# EAGLE design elektrosluch (EAGLE 6.4)
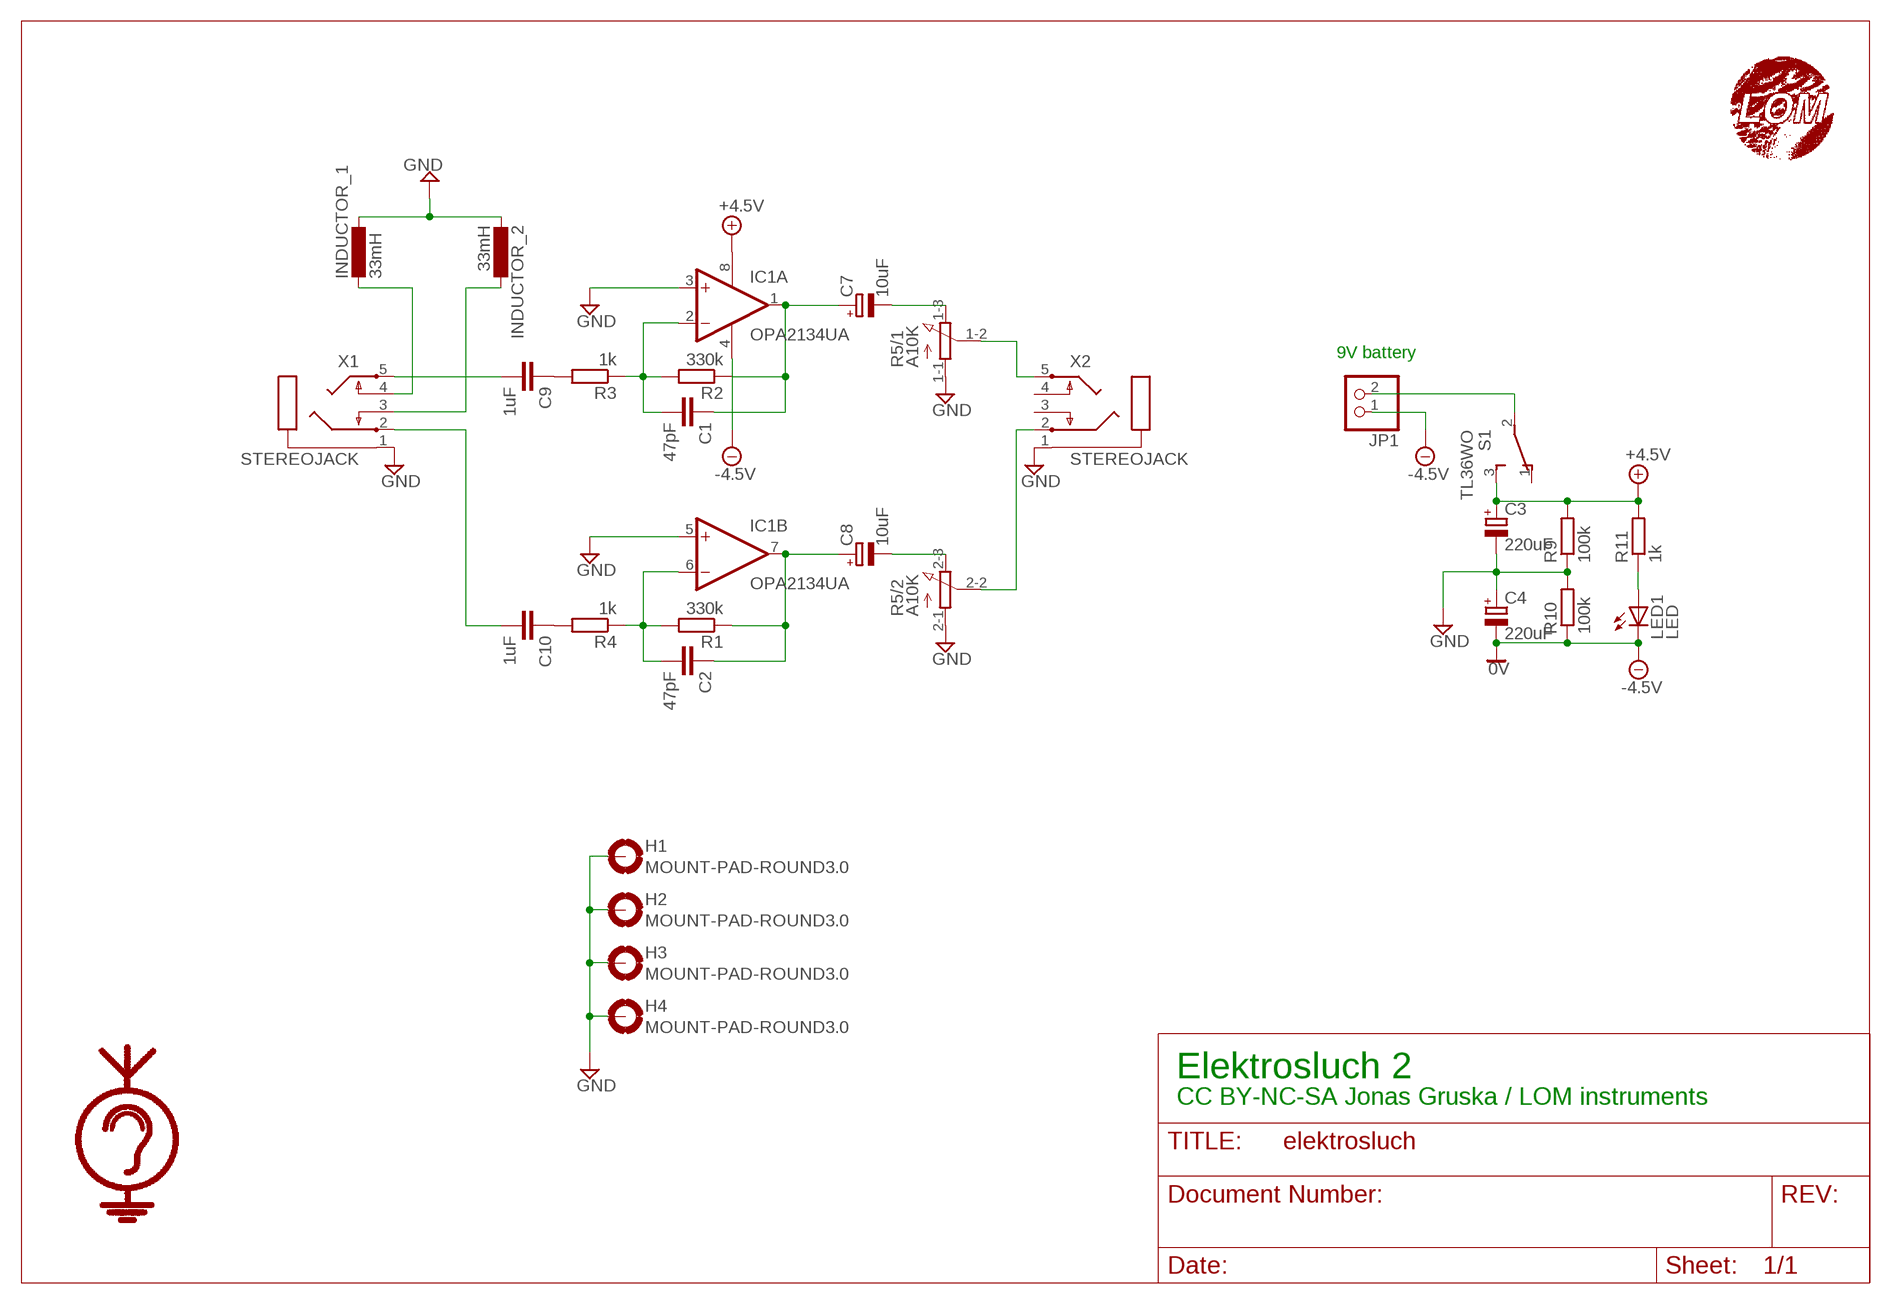
[diagram p0: schematic, sheet 1]

## Parts
C1  47pF  C-EUC1206  [C1206]
C2  47pF  C-EUC1206  [C1206]
C3  220uF  CPOL-EUD  [PANASONIC_D]
C4  220uF  CPOL-EUD  [PANASONIC_D]
C7  10uF  CPOL-EUB  [PANASONIC_B]
C8  10uF  CPOL-EUB  [PANASONIC_B]
C9  1uF  C-EUC1812  [C1812]
C10  1uF  C-EUC1812  [C1812]
H1  MOUNT-PAD-ROUND3.0  [3,0-PAD]
H2  MOUNT-PAD-ROUND3.0  [3,0-PAD]
H3  MOUNT-PAD-ROUND3.0  [3,0-PAD]
H4  MOUNT-PAD-ROUND3.0  [3,0-PAD]
IC1  OPA2134UA  [SO08]
INDUCTOR_1  33mH  COIL  [COIL]
INDUCTOR_2  33mH  COIL  [COIL]
JP1  PINHD-1X2  [1X02]
LED1  LED  [LED3MM]
R1  330k  R-EU_M1206  [M1206]
R2  330k  R-EU_M1206  [M1206]
R3  1k  R-EU_M1206  [M1206]
R4  1k  R-EU_M1206  [M1206]
R5  A10K  3RP/1610G  [3RP/1610G]
R9  100k  R-EU_M1206  [M1206]
R10  100k  R-EU_M1206  [M1206]
R11  1k  R-EU_M1206  [M1206]
S1  TL36WO  [TL3XWO]
U$3  LOM  [LOMLOGO]
U$5  ELEKTROSLUCH  [ELEKTROSLUCH]
X1  STEREOJACK  [STX3100]
X2  STEREOJACK  [STX3100]

## Nets
+5V: C3.+ IC1.8(A:V+) R9.2 R11.2 S1.3(S) ; supply symbol labelled +4.5V
-5V: C4.- IC1.4(A:V-) JP1.1 LED1.K(C) R10.1 ; supply symbol labelled -4.5V, 0V
GND: C3.- C4.+ H1.B3,0(MOUNT) H2.B3,0(MOUNT) H3.B3,0(MOUNT) H4.B3,0(MOUNT) IC1.3(A:+IN) IC1.5(B:+IN) INDUCTOR_1.P$1 INDUCTOR_2.P$2 R5.1-1 R5.2-1 R9.1 R10.2 X1.1 X2.1
N$1: C1.2 IC1.2(A:-IN) R2.2 R3.1
N$2: C1.1 C7.+ IC1.1(A:OUT) R2.1
N$3: C7.- R5.1-3
N$4: C2.2 IC1.6(B:-IN) R1.2 R4.1
N$5: C2.1 C8.+ IC1.7(B:OUT) R1.1
N$6: C8.- R5.2-3
N$7: R5.1-2 X2.5
N$8: C9.2 X1.5
N$9: R5.2-2 X2.2
N$10: C10.2 X1.2
N$11: C9.1 R3.2
N$12: INDUCTOR_1.P$2 X1.4
N$13: INDUCTOR_2.P$1 X1.3
N$14: LED1.A R11.1
N$15: C10.1 R4.2
N$16: JP1.2 S1.2(P)
Unconnected: S1.1(O) X2.3 X2.4

## Notes on the sheet
- 9V battery
- Elektrosluch 2
- CC BY-NC-SA Jonas Gruska / LOM instruments

## Library data of the parts
C1 C2 C9 C10 = rcl:C-EU: CAPACITOR, European symbol
C3 C4 C7 C8 = rcl:CPOL-EU: POLARIZED CAPACITOR, European symbol
H1-H4 = holes:MOUNT-PAD-ROUND: MOUNTING PAD, round
IC1 = linear:OPA2*: Dual Operational Amplifier Low Power, Single-Supply, Rail-To-Rail Operational Amplifier Source: http://focus.ti.com/lit/ds/symlink/opa2345.pdf http://focus.ti.com .. opa241.pdf http://focus.ti.com/lit/ds/symlink/opa2134.pdf
INDUCTOR_1 INDUCTOR_2 = mojakniznica:COIL
JP1 = pinhead:PINHD-1X2: PIN HEADER
LED1 = mojakniznica:LED
R1-R4 R9-R11 = rcl:R-EU_: RESISTOR, European symbol
R5 = pot:3RP/1610G: 16mm Potentiometer two level Source: http://www.alphapotentiometers.net/html/16mm_pot_2.html
S1 = switch:TL36WO: TINY SWITCH ON - ON Source: http://www2.produktinfo.conrad.com/datenblaetter/700000-724999/705152-da-01-de-Subminiaturschalter_TL_36WO.pdf
U$3 = mojakniznica:LOM; LOMLOGO: LOMLOGO
U$5 = mojakniznica:ELEKTROSLUCH
X1 X2 = adafruit:STEREOJACK: MIC/HEADPHONE JACK Stereo jack with two switches. Kycon STX3100, CUI SJ1-3555NG and/or 4UCon 05544

## Board
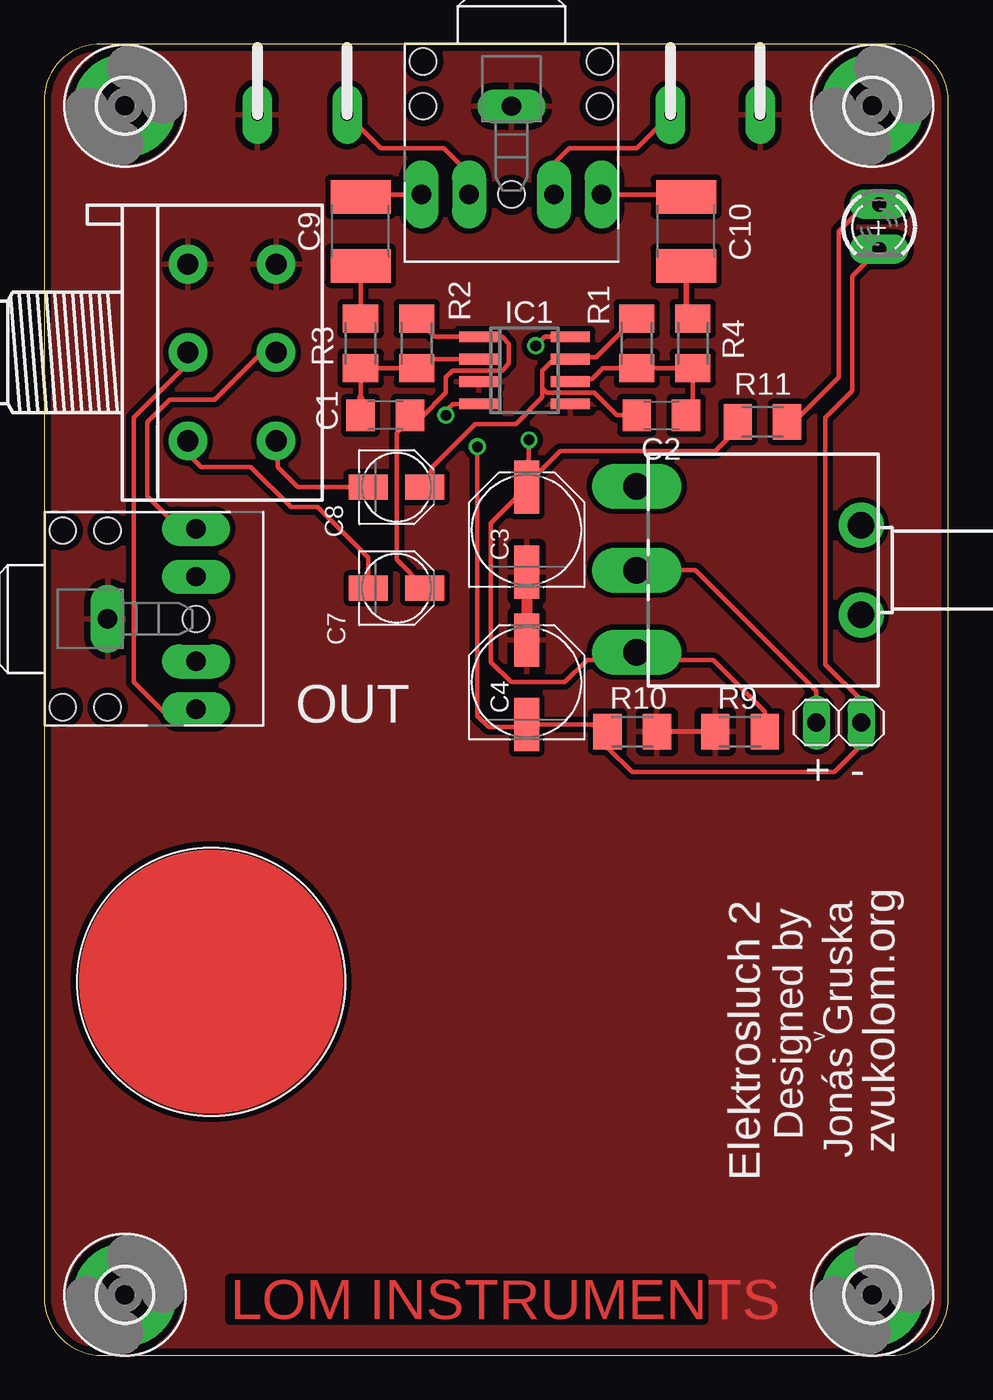
[diagram p1: board, top side]
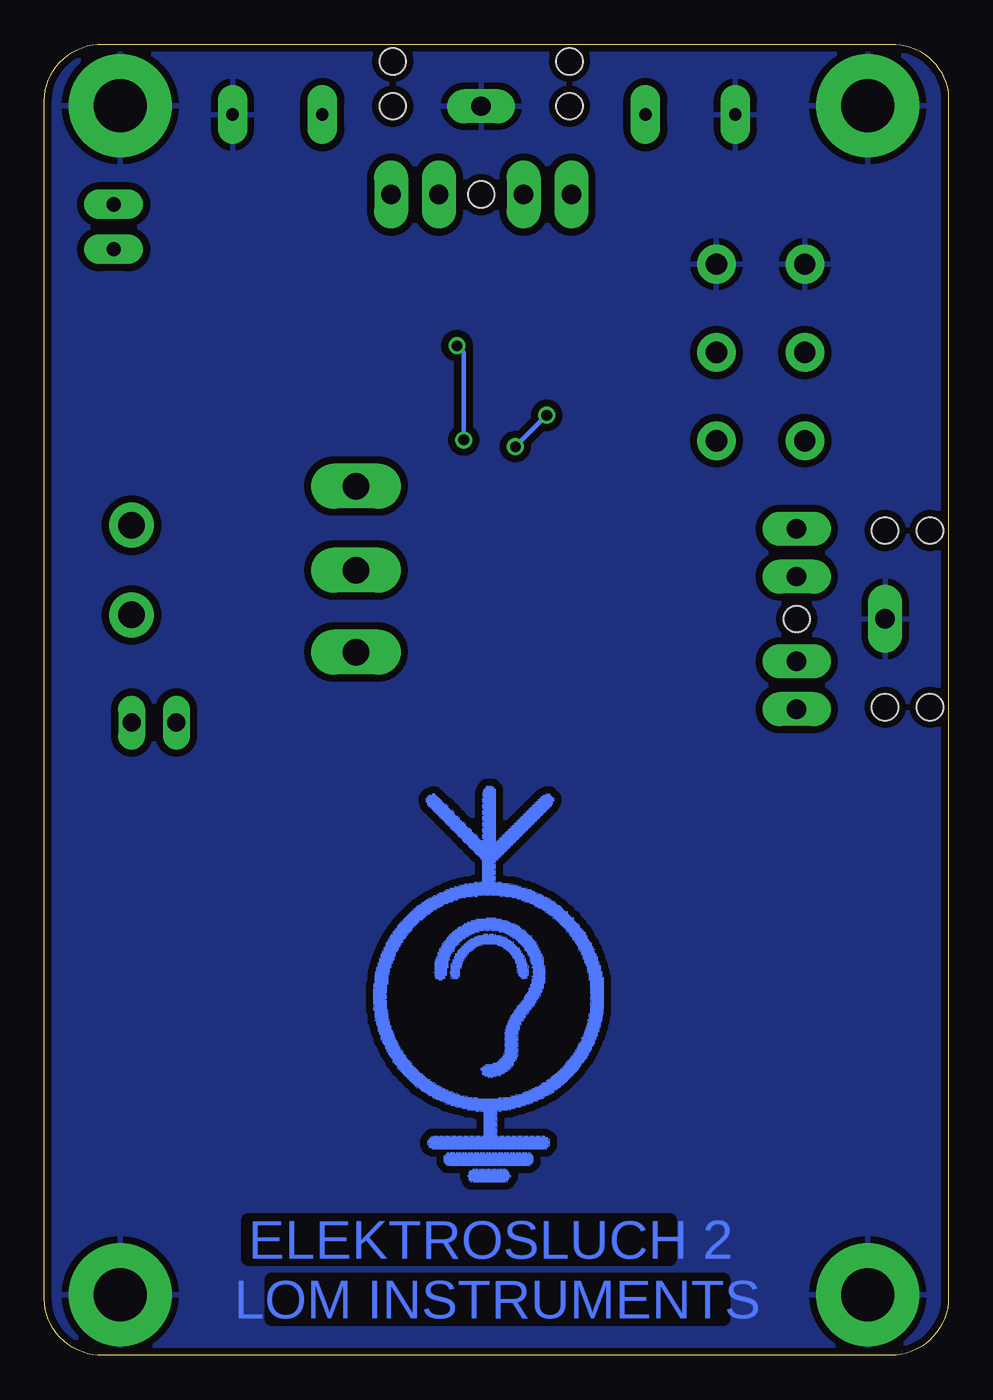
[diagram p2: board, bottom side, seen from below]

Size 51.17 x 74.22 mm. Coordinates in mm from the lower left corner, seen from the top.
Outline: 0,71.2 0,3.27 arc90 3.27,0 48.15,0 arc90 51.16,3.52 51.16,70.69 arc90 48.15,74.22 3.27,74.22 arc90 0,71.2
Copper layers (1*16): Top 0.0356mm / dielectric 1.5011mm / Bottom 0.0356mm
Design rules "LaenPCBOrder *": minimum track width 6mil, minimum drill 13mil, track to track 6mil, track to pad 6mil, pad to pad 6mil, via to via 6mil, smd to smd 6mil, copper to edge 15mil, drill to drill 6mil, minimum pad ring 7mil, minimum via ring 7mil, stop-mask expansion 3mil, vias tented up to drill 0mil, thermal gap 15mil

### Footprints (pad centres in the part's own frame; a part is rotated, then mirrored left to right if it is on the bottom)
C1206 = smd 1.6 x 1.8: 1 -1.4,0; 2 1.4,0
PANASONIC_D = smd 3 x 1.4: + 2.4,0; - -2.4,0
PANASONIC_B = smd 2.2 x 1.4: + 1.6,0; - -1.6,0
C1812 = smd 1.9 x 3.4: 1 -1.95,0; 2 1.95,0
3,0-PAD = drill 3 pad 5.842: B3,0 0,0
SO08 = smd 0.6 x 2.2: 1 -1.905,-2.6; 2 -0.635,-2.6; 3 0.635,-2.6; 4 1.905,-2.6; 5 1.905,2.6; 6 0.635,2.6; 7 -0.635,2.6; 8 -1.905,2.6
COIL = drill 0.7 pad 1.676 long: P$1 -2.54,0; P$2 2.54,0
1X02 = drill 1.016 long: 1 -1.27,0; 2 1.27,0
LED3MM = drill 0.8 pad 1.676 long: A -1.27,0; K 1.27,0
M1206 = smd 1.6 x 2: 1 -1.4,0; 2 1.4,0
3RP/1610G = drill 1.2 pad 2.184: 1-1 -5,0; 1-2 0,0; 1-3 5,0; 2-1 -5,5; 2-2 0,5; 2-3 5,5
TL3XWO = drill 1.5 pad 2.54 long: 1 -4.745,-5.08; 2 0,-5.08; 3 4.645,-5.08 | drill 1.5 pad 2.54: M1 -2.54,7.62; M2 2.54,7.62
STX3100 = drill 1.1 pad 1.93 long: 1 2.7,-0.1; 2 7.7,5; 3 7.7,2.3; 4 7.7,-2.5; 5 7.7,-5.2 | hole 1.5: 2.7,4.9; 2.7,-5.1; 7.7,-0.1; 2.7,4.9; 0.16,4.9; 2.7,-5.1; 0.16,-5.1

### Placement (x,y rotation side)
C1  19.3,53.21 180 top
C2  34.93,53.21 0 top
C3  27.3,46.74 90 top
C4  27.3,38.1 90 top
C7  19.94,43.43 0 top
C8  19.94,49.15 0 top
C9  17.91,63.63 90 top
C10  36.32,63.63 90 top
H1  46.86,3.43 0 top
H2  4.57,3.43 0 top
H3  46.86,70.74 0 top
H4  4.57,70.74 0 top
IC1  27.18,55.75 270 top
INDUCTOR_1  14.61,70.23 0 top
INDUCTOR_2  37.97,70.23 0 top
JP1  44.96,35.81 180 top
LED1  47.24,63.88 270 top
R1  33.53,57.28 270 top
R2  21.08,57.28 270 top
R3  17.91,57.28 90 top
R4  36.7,57.28 90 top
R5  8.13,56.77 270 top
R9  39.37,35.31 0 top
R10  33.27,35.31 0 top
R11  40.64,52.83 180 top
S1  38.61,44.45 270 top
U$3  2.16,13.84 0 top
U$5  26.04,19.81 0 top
X1  26.54,73.41 270 top
X2  0.89,41.78 0 top

### Tracks (layer width: path | path; a pad name or v marks a point on that pad's centre or on a via)
+5V  (via drill 0.6, 0.6 pad 0.25)
  Top 0.254: R9.2 40.77,36.45 37.85,39.37 33.6,39.37 30.73,39.37 29.46,38.1 26.42,38.1 25.27,39.24 25.27,47.1 C3.+ 26.67,48.64 | IC1.8 28.32,57.66 v27.81,57.15 | 26.67,48.64 27.43,50.8 v27.43,51.82 | R11.2 39.5,52.7 37.97,51.18 29.21,51.18 26.67,48.64
  Top 0.61: 33.6,39.37 S1.3
  Bottom 0.254: v27.43,51.82 27.43,56.77 v27.81,57.15
-5V  (via drill 0.6, 0.6 pad 0.25)
  Top 0.254: 31.05,35.69 R10.1 31.48,35.7 C4.- 27.16,35.56 25.15,35.56 24.51,36.2 v24.51,51.44 | v22.73,53.21 22.73,53.47 23.11,53.85 IC1.4 | 31.87,34.42 33.27,33.02 44.7,33.02 46.23,34.54 JP1.1 46.23,37.08 44.2,39.12 44.2,53.09 45.72,54.61 45.72,61.09 LED1.K
  Top 0.305: R10.1 31.87,34.42
  Bottom 0.254: v24.51,51.44 v22.73,53.21
GND
  Top 0.254: R9.1 R10.2
  Top 0.61: C3.- C4.+
  pour Top (isolate 0.305): 0.38,74.04 51.05,74.04 51.05,0.13 0.38,0.13
  pour Bottom (isolate 0.406): 0.38,0.13 0.3,74.04 51.05,74.04 51.05,0.13
N$1
  Top 0.254: IC1.2 21.59,56.39 | 17.91,54.23 R3.1 R2.2
  Top 0.406: 21.59,56.39 R2.2 | 17.91,54.23 C1.2
N$2
  Top 0.254: R2.1 22.1,57.66 IC1.1 25.91,57.66 26.29,57.28 26.29,56.13 25.91,55.75 23.11,55.75 22.73,55.37 22.73,54.48 21.34,53.09 20.83,53.09 C1.1 20.07,52.58 20.07,52.32 19.94,52.2 19.94,45.03 C7.+
  Top 0.406: C1.1 20.7,53.34
N$3
  Top 0.254: R5.1-3 8.13,51.05 8.89,50.29 11.68,50.29 13.97,48.01 15.49,48.01 18.34,45.16 C7.-
N$4
  Top 0.254: 36.7,53.84 R4.1 R1.2 31.62,55.88 30.99,55.24 29.91,55.24
  Top 0.305: 36.7,53.84 C2.2 | 29.91,55.24 IC1.6
N$5
  Top 0.254: C2.1 32.38,53.21 31.11,54.48 28.45,54.48 28.19,54.74 | 28.19,54.74 28.19,55.75 28.7,56.26 29.65,56.26 | 33.53,58.8 31.24,56.52 29.91,56.52 | C8.+ 21.99,50.31 24.38,52.7 26.67,52.7 28.19,54.23 28.19,54.74
  Top 0.305: 29.65,56.26 IC1.7 29.91,56.52 | R1.1 33.53,58.8
N$6
  Top 0.254: C8.- 14.35,49.15 13.21,50.29 13.21,52.32 R5.2-3
N$7
  Top 0.254: R5.1-2 8.13,56.13 5.08,53.09 5.08,38.1 6.98,36.2 8.2,36.2 X2.5
N$8
  Top 0.254: X1.5 18.84,65.71 18.54,65.41 18.08,65.41 C9.2
N$9
  Top 0.254: R5.2-2 12.87,57.32 9.65,54.1 7.11,54.1 5.84,52.83 5.84,48.64 7.7,46.78 X2.2
N$10
  Top 0.254: X1.2 36.07,65.71 C10.2
N$11
  Top 0.254: C9.1 R3.2
N$12
  Top 0.254: X1.4 24.04,66.89 22.61,68.33 19.05,68.33 INDUCTOR_1.P$2
N$13
  Top 0.254: X1.3 28.84,67.45 29.72,68.33 33.53,68.33 INDUCTOR_2.P$1
N$14
  Top 0.2: LED1.A 46.48,65.15
  Top 0.254: R11.1 42.42,52.83 44.96,55.37 44.96,63.63 46.48,65.15
N$15
  Top 0.305: C10.1 36.32,59.06 R4.2
N$16
  Top 0.254: JP1.2 43.69,37.59 36.83,44.45 S1.2

### Text on the board
Top: LOM INSTRUMENTS
Bottom: ELEKTROSLUCH 2 | LOM INSTRUMENTS
tNames: OUT | + | - | v | Designed by | Jonás Gruska | zvukolom.org | Elektrosluch 2
tStop: EAR1 | EAR2 | LOM INSTRUMENTS
bStop: ELEKTROSLUCH 2 | LOM INSTRUMENTS